# EAGLE design breakout_v3 (EAGLE 9.6.2)
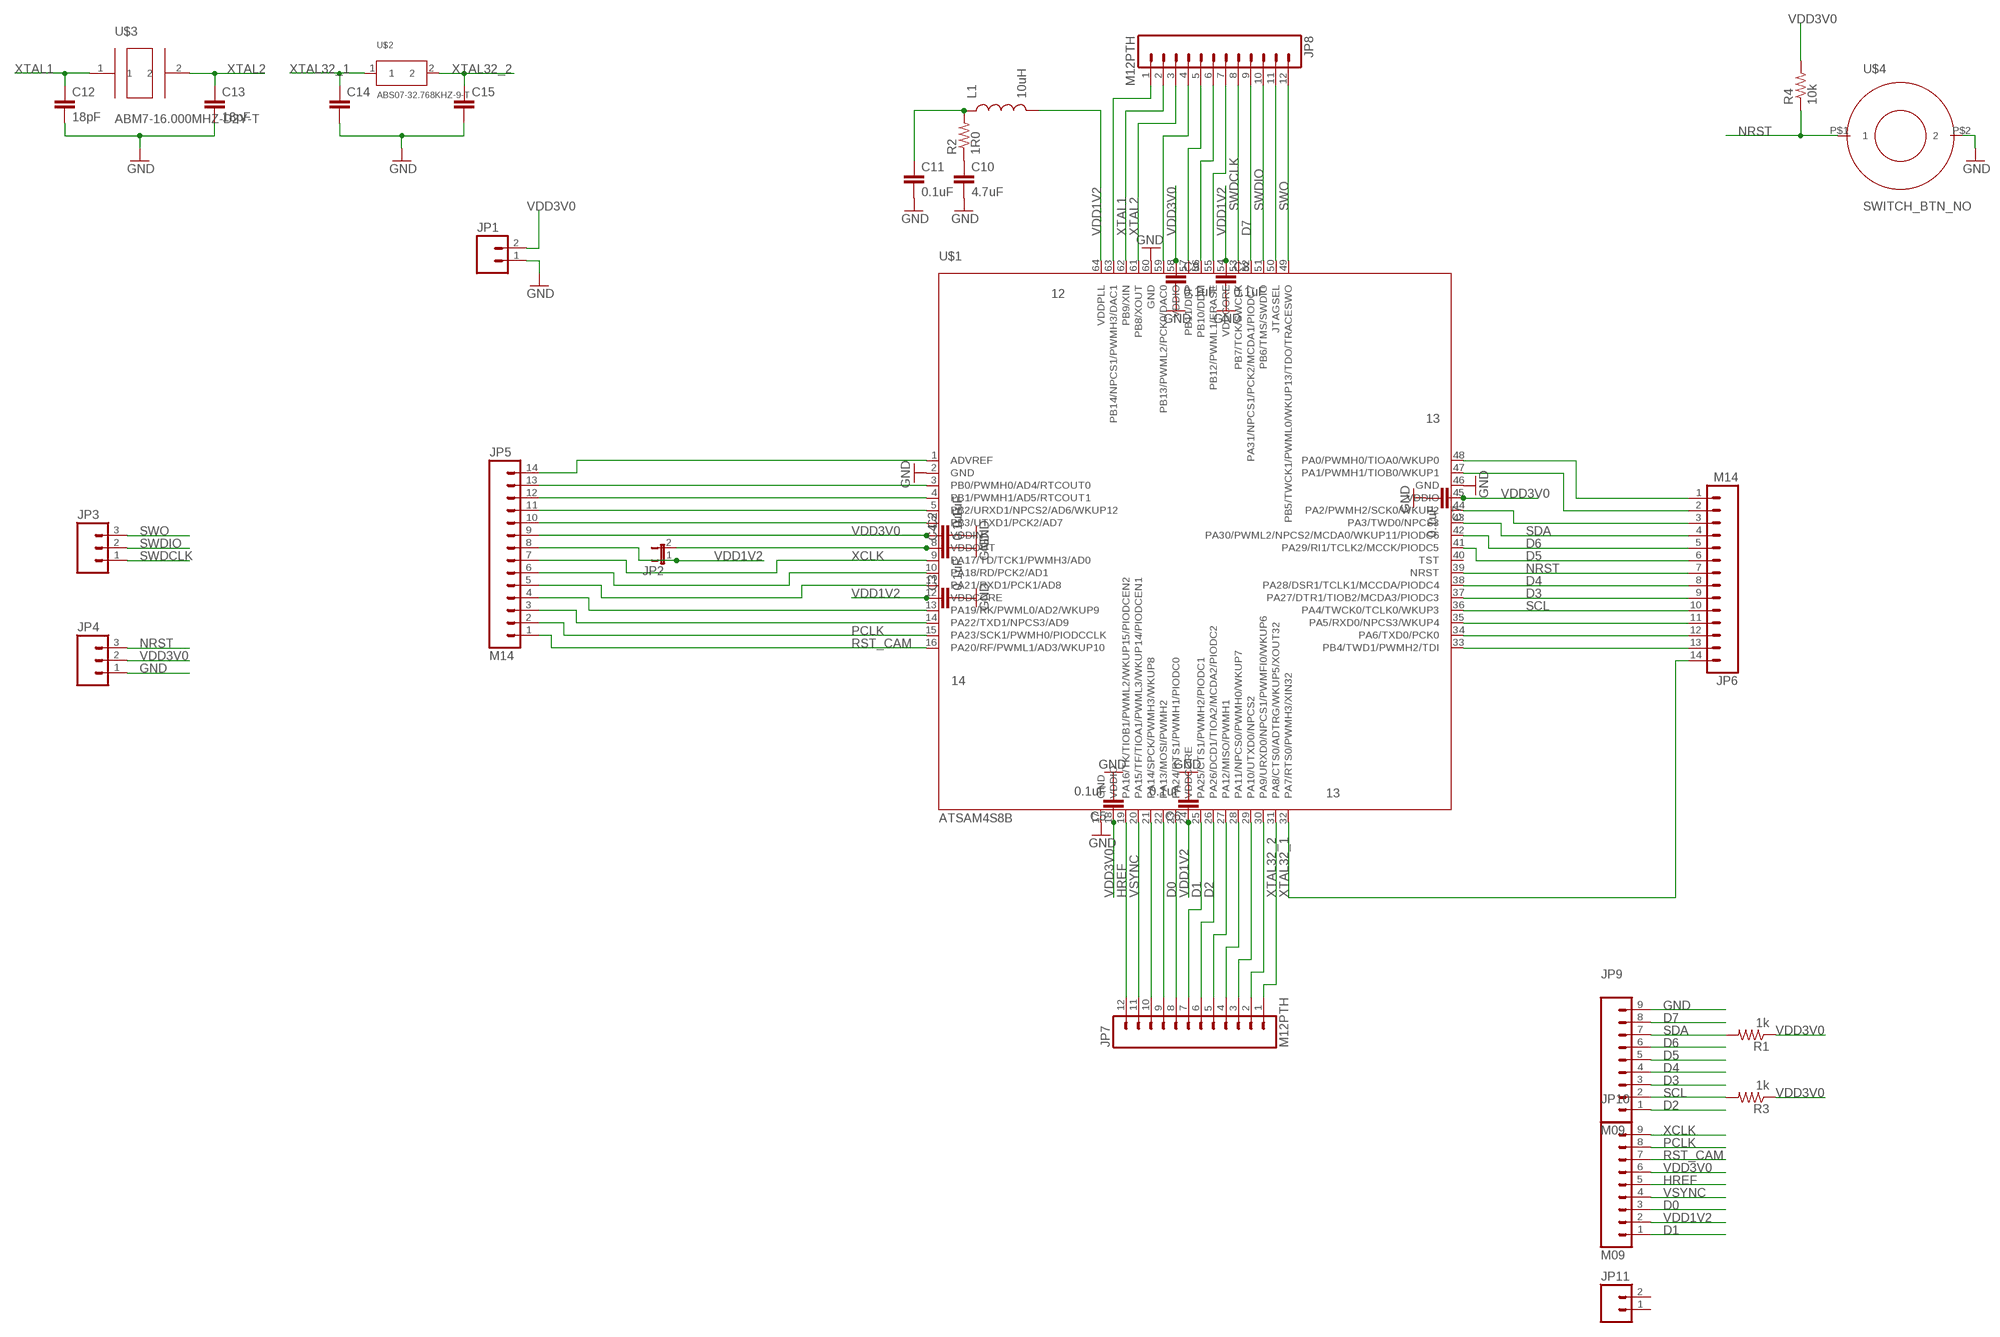
[diagram p0: schematic, sheet 1]

## Parts
C2  0.1uF  CAP0805  [0805]
C3  0.1uF  CAP0805  [0805]
C4  0.1uF  CAP0805  [0805]
C5  0.1uF  CAP0805  [0805]
C6  0.1uF  CAP0805  [0805]
C7  0.1uF  CAP0805  [0805]
C8  0.1uF  CAP0805  [0805]
C9  0.1uF  CAP0805  [0805]
C10  4.7uF  CAP0805  [0805]
C11  0.1uF  CAP0805  [0805]
C12  18pF  CAP0805  [0805]
C13  18pF  CAP0805  [0805]
C14  CAP0805  [0805]
C15  CAP0805  [0805]
JP1  M02PTH  [1X02]
JP2  JUMPER-2PTH  [1X02]
JP3  M03PTH  [1X03]
JP4  M03PTH  [1X03]
JP5  M14  [1X14]
JP6  M14  [1X14]
JP7  M12PTH  [1X12]
JP8  M12PTH  [1X12]
JP9  M09  [1X09]
JP10  M09  [1X09]
JP11  M02PTH  [1X02]
L1  10uH  INDUCTOR0805  [0805]
R1  1k  RESISTOR0805-RES  [0805]
R2  1R0  RESISTOR0805-RES  [0805]
R3  1k  RESISTOR0805-RES  [0805]
R4  10k  RES  [0805]
U$1  ATSAM4S8B  [QFP50P1200X1200X160-64N]
U$2  ABS07-32.768KHZ-9-T  [ABS07-32.768KHZ-9-T]
U$3  ABM7-16.000MHZ-D2Y-T  [ABM7-16.000MHZ-D2Y-T]
U$4  SWITCH_BTN_NO  [BTN_2]

## Nets
D0: JP7.8 JP10.3 U$1.23(PA24/RTS1/PWMH1/PIODC0)
D1: JP7.7 JP10.1 U$1.25(PA25/CTS1/PWMH2/PIODC1)
D2: JP7.6 JP9.1 U$1.26(PA26/DCD1/TIOA2/MCDA2/PIODC2)
D3: JP6.9 JP9.3 U$1.37(PA27/DTR1/TIOB2/MCDA3/PIODC3)
D4: JP6.8 JP9.4 U$1.38(PA28/DSR1/TCLK1/MCCDA/PIODC4)
D5: JP6.6 JP9.5 U$1.41(PA29/RI1/TCLK2/MCCK/PIODC5)
D6: JP6.5 JP9.6 U$1.42(PA30/PWML2/NPCS2/MCDA0/WKUP11/PIODC6)
D7: JP8.9 JP9.8 U$1.52(PA31/NPCS1/PCK2/MCDA1/PIODC7)
GND: C2.2 C3.2 C4.2 C5.2 C6.2 C7.2 C8.2 C9.2 C10.2 C11.2 C12.2 C13.2 C14.2 C15.2 JP1.1 JP4.1 JP9.9 U$1.2(GND) U$1.17(GND) U$1.46(GND) U$1.60(GND) U$4.P$2
HREF: JP7.12 JP10.5 U$1.19(PA16/TK/TIOB1/PWML2/WKUP15/PIODCEN2)
N$1: C4.1 JP2.2 U$1.8(VDDOUT)
N$2: C11.1 L1.1 R2.2
N$3: C10.1 R2.1
N$10: JP5.14 U$1.1(ADVREF)
N$11: JP5.13 U$1.3(PB0/PWMH0/AD4/RTCOUT0)
N$12: JP5.12 U$1.4(PB1/PWMH1/AD5/RTCOUT1)
N$13: JP5.11 U$1.5(PB2/URXD1/NPCS2/AD6/WKUP12)
N$14: JP5.10 U$1.6(PB3/UTXD1/PCK2/AD7)
N$16: JP5.6 U$1.10(PA18/RD/PCK2/AD1)
N$17: JP5.5 U$1.11(PA21/RXD1/PCK1/AD8)
N$18: JP5.4 U$1.13(PA19/RK/PWML0/AD2/WKUP9)
N$19: JP5.3 U$1.14(PA22/TXD1/NPCS3/AD9)
N$24: JP7.10 U$1.21(PA14/SPCK/PWMH3/WKUP8)
N$25: JP7.9 U$1.22(PA13/MOSI/PWMH2)
N$29: JP7.5 U$1.27(PA12/MISO/PWMH1)
N$30: JP7.4 U$1.28(PA11/NPCS0/PWMH0/WKUP7)
N$31: JP7.3 U$1.29(PA10/UTXD0/NPCS2)
N$32: JP7.2 U$1.30(PA9/URXD0/NPCS1/PWMFI0/WKUP6)
N$33: JP6.13 U$1.33(PB4/TWD1/PWMH2/TDI)
N$34: JP6.12 U$1.34(PA6/TXD0/PCK0)
N$35: JP6.11 U$1.35(PA5/RXD0/NPCS3/WKUP4)
N$42: JP6.3 U$1.44(PA2/PWMH2/SCK0/WKUP2)
N$43: JP6.2 U$1.47(PA1/PWMH1/TIOB0/WKUP1)
N$44: JP6.1 U$1.48(PA0/PWMH0/TIOA0/WKUP0)
N$45: JP8.11 U$1.50(JTAGSEL)
N$47: JP8.7 U$1.55(PB12/PWML1/ERASE)
N$48: JP8.6 U$1.56(PB10/DDM)
N$49: JP8.5 U$1.57(PB11/DDP)
N$50: JP8.4 U$1.59(PB13/PWML2/PCK0/DAC0)
N$51: JP8.1 U$1.63(PB14/NPCS1/PWMH3/DAC1)
NRST: JP4.3 JP6.7 R4.1 U$1.39(NRST) U$4.P$1
PCLK: JP5.2 JP10.8 U$1.15(PA23/SCK1/PWMH0/PIODCCLK)
RST_CAM: JP5.1 JP10.7 U$1.16(PA20/RF/PWML1/AD3/WKUP10)
SCL: JP6.10 JP9.2 R3.2 U$1.36(PA4/TWCK0/TCLK0/WKUP3)
SDA: JP6.4 JP9.7 R1.2 U$1.43(PA3/TWD0/NPCS3)
SWDCLK: JP3.1 JP8.8 U$1.53(PB7/TCK/SWCLK)
SWDIO: JP3.2 JP8.10 U$1.51(PB6/TMS/SWDIO)
SWO: JP3.3 JP8.12 U$1.49(PB5/TWCK1/PWML0/WKUP13/TDO/TRACESWO)
VDD1V2: C3.1 C6.1 C8.1 JP2.1 JP5.8 JP10.2 L1.2 U$1.12(VDDCORE) U$1.24(VDDCORE) U$1.54(VDDCORE) U$1.64(VDDPLL)
VDD3V0: C2.1 C5.1 C7.1 C9.1 JP1.2 JP4.2 JP5.9 JP10.6 R1.1 R3.1 R4.2 U$1.7(VDDIN) U$1.18(VDDIO) U$1.45(VDDIO) U$1.58(VDDIO)
VSYNC: JP7.11 JP10.4 U$1.20(PA15/TF/TIOA1/PWML3/WKUP14/PIODCEN1)
XCLK: JP5.7 JP10.9 U$1.9(PA17/TD/TCK1/PWMH3/AD0)
XTAL1: C12.1 JP8.2 U$1.62(PB9/XIN) U$3.1
XTAL2: C13.1 JP8.3 U$1.61(PB8/XOUT) U$3.2
XTAL32_1: C14.1 JP6.14 U$1.32(PA7/RTS0/PWMH3/XIN32) U$2.1
XTAL32_2: C15.1 JP7.1 U$1.31(PA8/CTS0/ADTRG/WKUP5/XOUT32) U$2.2
Unconnected: JP11.1 JP11.2 U$1.40(TST)

## Notes on the sheet
- 12
- 13
- 14
- 13

## Library data of the parts
C2-C15 = SparkFun:CAP: Capacitor Standard 0603 ceramic capacitor, and 0.1" leaded capacitor.
JP1 JP11 = SparkFun:M02: Header 2 Standard 2-pin 0.1" header. Use with straight break away headers (SKU : PRT-00116), right angle break away headers (PRT-00553), swiss pins (PRT-00743), machine pins (PRT-00117), and female headers (PRT-00115). Molex polarized connector foot print use with SKU : PRT-08233 with associated crimp pins and housings.
JP2 = SparkFun:JUMPER-2: Jumper Basic 0.1" spaced jumper. Use with breakaway headers.
JP3 JP4 = SparkFun:M03: Header 3 Standard 3-pin 0.1" header. Use with straight break away headers (SKU : PRT-00116), right angle break away headers (PRT-00553), swiss pins (PRT-00743), machine pins (PRT-00117), and female headers (PRT-00115). Molex polarized connector foot print use with SKU : PRT-08232 with associated crimp pins and housings.
JP5 JP6 = SparkFun:M14: Header 14 Standard 14-pin 0.1" header. Use with straight break away headers (SKU : PRT-00116), right angle break away headers (PRT-00553), swiss pins (PRT-00743), machine pins (PRT-00117), and female headers (PRT-00115).
JP7 JP8 = SparkFun:M12: Header 12 Standard 12-pin 0.1" header. Use with straight break away headers (SKU : PRT-00116), right angle break away headers (PRT-00553), swiss pins (PRT-00743), machine pins (PRT-00117), and female headers (PRT-00115).
JP9 JP10 = SparkFun:M09: Header 9 Standard 9-pin 0.1" header. Use with straight break away headers (SKU : PRT-00116), right angle break away headers (PRT-00553), swiss pins (PRT-00743), machine pins (PRT-00117), and female headers (PRT-00115).
L1 = SparkFun:INDUCTOR: Inductors Basic Inductor/Choke - 0603 and 1206. Footprints are not proven and vary greatly between part numbers.
R1-R3 = SparkFun:RESISTOR: Resistor Basic schematic elements and footprints for 0603, 1206, and PTH resistors.
R4 = Ilya_Teach:RES
U$1 = Ilya:ATSAM4S8B
U$2 = Ilya:ABS07-32.768KHZ-9-T
U$3 = Ilya:ABM7-16.000MHZ-D2Y-T
U$4 = Ilya_Teach:SWITCH_BTN_NO

## Board
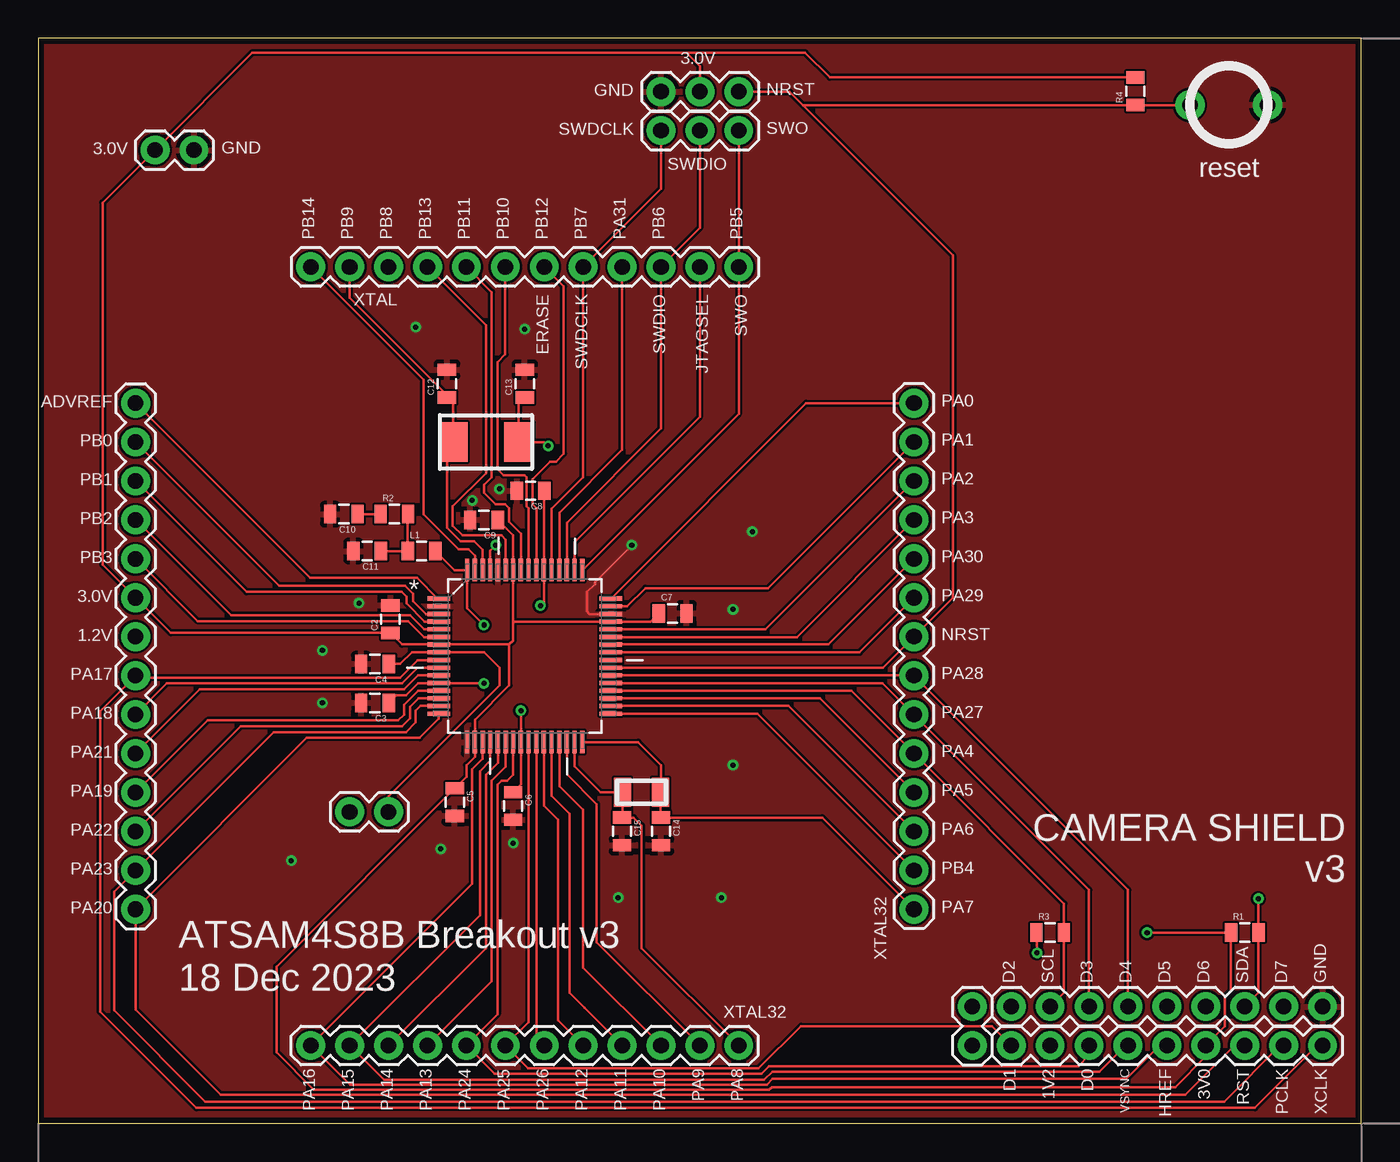
[diagram p1: board, top side]
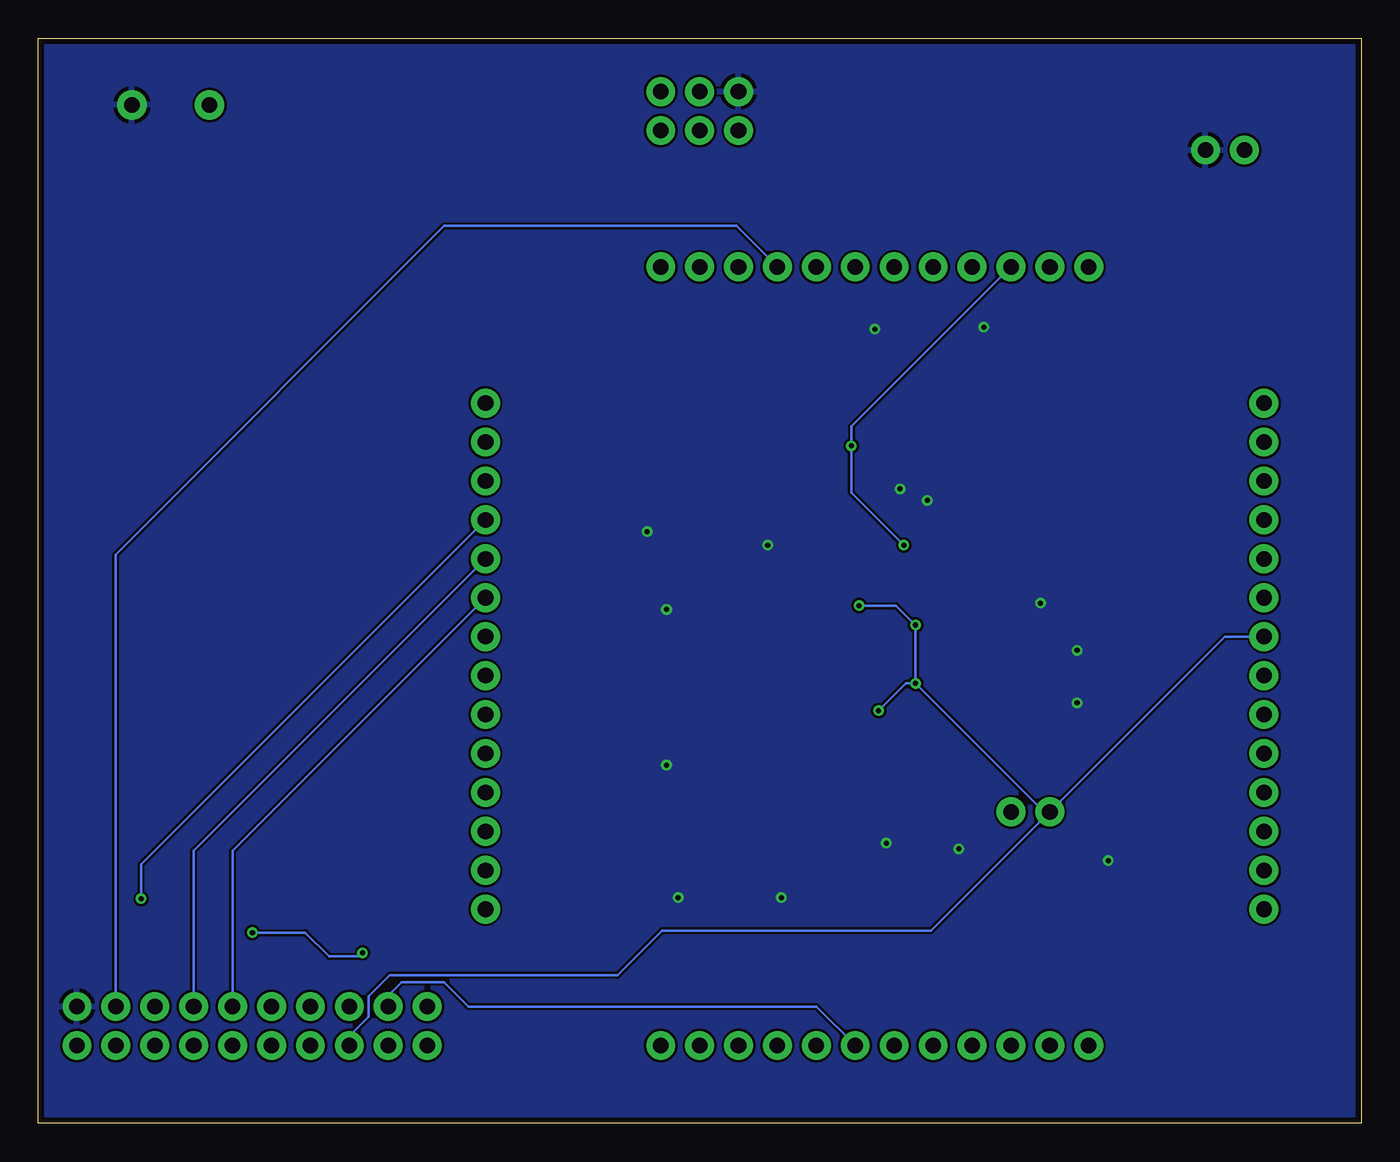
[diagram p2: board, bottom side, seen from below]

Size 86.34 x 70.79 mm. Coordinates in mm from the lower left corner, seen from the top.
Outline: 0,0 86.34,0 86.34,70.79 0,70.79 0,0
Copper layers (1*16): Top 0.0356mm / dielectric 1.5011mm / Bottom 0.0356mm
Design rules "LaenPCBOrder": minimum track width 6mil, minimum drill 13mil, track to track 6mil, track to pad 6mil, pad to pad 6mil, via to via 6mil, smd to smd 6mil, copper to edge 15mil, drill to drill 6mil, minimum pad ring 7mil, minimum via ring 7mil, stop-mask expansion 4mil, vias tented up to drill 0mil, thermal gap 10mil

### Footprints (pad centres in the part's own frame; a part is rotated, then mirrored left to right if it is on the bottom)
0805 = smd 0.8 x 1.2: 1 -0.9,0; 2 0.9,0
1X02 = drill 1.016 pad 1.88: 1 0,0; 2 2.54,0
1X03 = drill 1.016 pad 1.88: 1 0,0; 2 2.54,0; 3 5.08,0
1X14 = drill 1.016 pad 1.88: 1 0,0; 2 2.54,0; 3 5.08,0; 4 7.62,0; 5 10.16,0; 6 12.7,0; 7 15.24,0; 8 17.78,0; 9 20.32,0; 10 22.86,0; 11 25.4,0; 12 27.94,0; 13 30.48,0; 14 33.02,0
1X12 = drill 1.016 pad 1.88: 1 0,0; 2 2.54,0; 3 5.08,0; 4 7.62,0; 5 10.16,0; 6 12.7,0; 7 15.24,0; 8 17.78,0; 9 20.32,0; 10 22.86,0; 11 25.4,0; 12 27.94,0
1X09 = drill 1.016 pad 1.88: 1 0,0; 2 2.54,0; 3 5.08,0; 4 7.62,0; 5 10.16,0; 6 12.7,0; 7 15.24,0; 8 17.78,0; 9 20.32,0
QFP50P1200X1200X160-64N = smd 1.473 x 0.279: 1 -5.613,3.759; 2 -5.613,3.251; 3 -5.613,2.743; 4 -5.613,2.261; 5 -5.613,1.753; 6 -5.613,1.245; 7 -5.613,0.762; 8 -5.613,0.254; 9 -5.613,-0.254; 10 -5.613,-0.762; 11 -5.613,-1.245; 12 -5.613,-1.753; 13 -5.613,-2.261; 14 -5.613,-2.743; 15 -5.613,-3.251; 16 -5.613,-3.759; 33 5.613,-3.759; 34 5.613,-3.251; 35 5.613,-2.743; 36 5.613,-2.261; 37 5.613,-1.753; 38 5.613,-1.245; 39 5.613,-0.762; 40 5.613,-0.254; 41 5.613,0.254; 42 5.613,0.762; 43 5.613,1.245; 44 5.613,1.753; 45 5.613,2.261; 46 5.613,2.743; 47 5.613,3.251; 48 5.613,3.759 | smd 0.279 x 1.473: 17 -3.759,-5.613; 18 -3.251,-5.613; 19 -2.743,-5.613; 20 -2.261,-5.613; 21 -1.753,-5.613; 22 -1.245,-5.613; 23 -0.762,-5.613; 24 -0.254,-5.613; 25 0.254,-5.613; 26 0.762,-5.613; 27 1.245,-5.613; 28 1.753,-5.613; 29 2.261,-5.613; 30 2.743,-5.613; 31 3.251,-5.613; 32 3.759,-5.613; 49 3.759,5.613; 50 3.251,5.613; 51 2.743,5.613; 52 2.261,5.613; 53 1.753,5.613; 54 1.245,5.613; 55 0.762,5.613; 56 0.254,5.613; 57 -0.254,5.613; 58 -0.762,5.613; 59 -1.245,5.613; 60 -1.753,5.613; 61 -2.261,5.613; 62 -2.743,5.613; 63 -3.251,5.613; 64 -3.759,5.613
ABS07-32.768KHZ-9-T = smd 1.1 x 1.9: 1 -1.25,0; 2 1.25,0
ABM7-16.000MHZ-D2Y-T = smd 1.9 x 2.6: 1 -2.15,0; 2 2.15,0
BTN_2 = drill 1.016 pad 1.93: P$1 -2.54,0; P$2 2.54,0

### Placement (x,y rotation side)
C2  22.99,32.89 90 top
C3  21.97,27.43 180 top
C4  21.97,29.97 180 top
C5  27.18,20.95 270 top
C6  30.99,20.7 270 top
C7  41.4,33.27 0 top
C8  32.13,41.27 180 top
C9  29.08,39.37 180 top
C10  19.94,39.75 180 top
C11  21.46,37.34 180 top
C12  26.67,48.26 90 top
C13  31.75,48.26 90 top
C14  40.64,19.05 270 top
C15  38.1,19.05 270 top
JP1  10.16,63.5 180 top
JP2  20.32,20.32 0 top
JP3  40.64,64.77 0 top
JP4  40.64,67.31 0 top
JP5  6.35,13.97 90 top
JP6  57.15,46.99 270 top
JP7  45.72,5.08 180 top
JP8  17.78,55.88 0 top
JP9  63.5,7.62 0 top
JP10  63.5,5.08 0 top
JP11  60.96,5.08 90 top
L1  25.02,37.34 0 top
R1  78.74,12.45 0 top
R2  23.24,39.75 0 top
R3  66.04,12.45 0 top
R4  71.6,67.34 90 top
U$1  31.75,30.48 0 top
U$2  39.37,21.59 180 top
U$3  29.21,44.45 0 top
U$4  77.7,66.45 0 top

### Tracks (layer width: path | path; a pad name or v marks a point on that pad's centre or on a via)
D0
  Top 0.152: U$1.23 30.99,22.73 30.61,22.35 30.23,22.35 29.97,22.1 29.97,7.11 JP7.8 29.79,3.23 47.19,3.23 47.7,3.73 67.87,3.73 68.58,4.45 JP10.3
D1
  Top 0.152: U$1.25 32,6.6 JP7.7 31.98,3.58 47.02,3.58 49.78,6.35 62.23,6.35 JP10.1
D2
  Top 0.152: U$1.26 32.51,5.59 JP7.6
  Bottom 0.152: JP7.6 35.56,7.62 58.27,7.62 59.84,9.2 62.64,9.2 63.5,8.33 JP9.1
D3
  Top 0.152: U$1.37 55.09,28.73 JP6.9 68.58,15.24 JP9.3
D4
  Top 0.152: U$1.38 57.12,29.23 JP6.8 71.12,15.24 JP9.4
D5
  Top 0.152: U$1.41 53.59,30.73 JP6.6
  Bottom 0.152: JP9.5 73.66,17.78 JP6.6
D6
  Top 0.152: U$1.42 51.56,31.24 JP6.5
  Bottom 0.152: JP9.6 76.2,17.78 JP6.5
D7
  Top 0.152: U$1.52 34.01,39.85 38.1,43.94 JP8.9
  Bottom 0.152: JP9.8 81.28,37.11 59.84,58.55 40.77,58.55 JP8.9
GND  (via drill 0.33)
  Top 0.152: U$1.46 35.99,33.22 35.81,33.4 35.81,34.67 36.32,35.18 36.32,35.31 v38.73,37.72
  other vias: 45.34,33.53 28.32,40.64 31.75,51.82 24.64,51.94 37.85,14.73 30.99,18.29 18.54,30.86 18.54,27.43 30.1,41.4 44.58,14.73 46.61,38.61 45.34,23.37 26.26,17.91 16.51,17.14 20.93,33.93
  pour Top: 0,0 86.36,0 86.36,71.12 0,71.12
  pour Bottom: 0,0 86.36,0 86.36,71.12 0,71.12
HREF
  Top 0.152: U$1.19 29.01,23.8 28.32,23.11 28.32,15.62 JP7.12 20.34,2.52 47.55,2.52 47.93,2.9 71.02,2.9 73.2,5.08 JP10.5
N$1
  Top 0.152: C4.1 23.62,29.97 24.38,30.73 U$1.8 29.08,30.73 30.1,29.72 30.1,28.57 22.86,21.34 JP2.2
N$2
  Top 0.152: R2.2 24.12,39.73 L1.1 C11.1
N$3
  Top 0.152: R2.1 C10.1
N$10
  Top 0.152: U$1.1 26.06,34.24 24.71,35.59 17.76,35.59 JP5.14
N$11
  Top 0.152: U$1.3 25.3,33.22 24.46,34.06 24.46,34.54 23.93,35.08 15.72,35.08 JP5.13
N$12
  Top 0.152: U$1.4 25.22,32.74 24.03,33.93 24.03,34.34 23.7,34.67 13.59,34.67 JP5.12
N$13
  Top 0.152: U$1.5 25.17,32.23 24.26,33.15 12.57,33.15 JP5.11
N$14
  Top 0.152: U$1.6 25.17,31.73 24.13,32.77 10.41,32.77 JP5.10
N$16
  Top 0.152: U$1.10 24.77,29.72 23.75,28.7 8.38,28.7 JP5.6
N$17
  Top 0.152: U$1.11 24.79,29.23 23.88,28.32 10.54,28.32 JP5.5
N$18
  Top 0.152: U$1.13 24.79,28.22 23.88,27.3 23.88,26.67 23.49,26.29 11.05,26.29 JP5.4
N$19
  Top 0.152: U$1.14 24.82,27.74 24.26,27.18 24.26,26.42 23.75,25.91 13.21,25.91 JP5.3
N$24
  Top 0.152: U$1.21 30,23.52 29.21,22.73 29.21,11.43 JP7.10
N$25
  Top 0.152: U$1.22 30.51,23.27 29.59,22.35 29.59,9.27 JP7.9
N$29
  Top 0.152: U$1.27 33,20.73 33.91,19.81 33.91,6.73 JP7.5
N$30
  Top 0.152: U$1.28 33.5,21.36 34.67,20.19 34.67,8.51 35.65,7.53 JP7.4
N$31
  Top 0.152: U$1.29 34.01,22 35.56,20.45 35.56,10.16 JP7.3
N$32
  Top 0.152: U$1.30 34.49,22.78 36.45,20.83 36.45,11.81 JP7.2
N$33
  Top 0.152: U$1.33 46.94,26.72 JP6.13
N$34
  Top 0.152: U$1.34 48.97,27.23 JP6.12
N$35
  Top 0.152: U$1.35 51,27.74 JP6.11
N$42
  Top 0.152: U$1.44 47.47,32.23 JP6.3
N$43
  Top 0.152: U$1.47 38.43,33.73 39.62,34.92 47.62,34.92 JP6.2
N$44
  Top 0.152: U$1.48 50.11,46.99 JP6.1
N$45
  Top 0.152: U$1.50 35,37.92 43.18,46.1 JP8.11
N$47
  Top 0.152: U$1.55 32.51,40.13 32.26,40.39 32.26,42.04 33.4,43.18 33.78,43.18 34.29,43.69 34.29,54.61 JP8.7
N$48
  Top 0.152: U$1.56 32,40.13 31.88,40.26 31.88,42.16 31.75,42.29 30.35,42.29 29.97,42.67 29.97,49.66 30.48,50.16 JP8.6
N$49
  Top 0.152: JP8.5 29.59,54.23 29.59,42.16 29.08,41.66 29.08,41.15 29.84,40.39 30.48,40.39 30.73,40.13 30.73,39.24 31.5,38.48 U$1.57
N$50
  Top 0.152: JP8.4 29.21,52.07 29.21,42.42 27.05,40.26 27.05,38.99 27.69,38.35 30.23,38.35 30.51,38.08 U$1.59
N$51
  Top 0.152: JP8.1 25.15,48.51 25.15,39.75 27.43,37.47 28.07,37.47 28.5,37.03 U$1.63
NRST
  Top 0.152: U$1.39 55.12,29.72 JP6.7 59.69,34.29 59.69,56.64 49.91,66.42 | JP4.3 49.02,67.31 49.91,66.42 | U$4.P$1 75.15,66.44 R4.1 49.93,66.44 49.91,66.42
PCLK
  Top 0.152: U$1.15 24.94,27.23 24.64,26.92 24.64,26.16 24,25.53 15.37,25.53 JP5.2 4.95,15.11 4.95,7.37 10.9,1.42 77.39,1.42 81.05,5.08 JP10.8
RST_CAM
  Top 0.152: U$1.16 26.14,26.39 24.89,25.15 17.53,25.15 JP5.1 6.35,7.42 11.91,1.85 74.85,1.85 78.08,5.08 JP10.7
SCL
  Top 0.152: U$1.36 53.06,28.22 JP6.10 66.94,14.34 R3.2 66.94,8.52 JP9.2
SDA  (via drill 0.33)
  Top 0.152: U$1.43 49.51,31.73 JP6.4 | JP9.7 79.64,8.52 R1.2 79.64,14.64 v79.63,14.66
  Bottom 0.152: JP6.4 79.63,16.89 v79.63,14.66
SWDCLK
  Top 0.152: U$1.53 33.5,40.11 35.56,42.16 JP8.8 40.64,60.96 JP3.1
SWDIO
  Top 0.152: U$1.51 34.49,39.19 40.64,45.34 JP8.10 43.18,58.42 JP3.2
SWO
  Top 0.152: U$1.49 45.72,46.3 JP8.12 JP3.3
VDD1V2  (via drill 0.33)
  Top 0.152: C8.1 33,41.24 U$1.54 33,34.01 v32.77,33.78 | L1.2 27.16,36.09 U$1.64 27.99,33.6 v29.08,32.51 | v29.08,28.7 29.06,28.73 U$1.12 24.79,28.73 24,27.94 23.38,27.94 C3.1 | v31.5,26.92 U$1.24 31.5,22.11 C6.1
  Bottom 0.152: v29.08,28.7 29.72,28.7 v31.5,26.92 | v29.08,28.7 v29.08,32.51 30.35,33.78 v32.77,33.78 | JP2.1 20.7,20.32 v29.08,28.7 | JP5.8 8.89,31.75 JP2.1 | JP2.1 28.07,12.57 45.62,12.57 48.54,9.65 63.42,9.65 64.77,8.31 64.77,6.96 66.04,5.69 JP10.2
VDD3V0  (via drill 0.33)
  Top 0.152: C9.1 30.99,38.37 U$1.58 30.99,32.77 | 30.99,32.77 30.99,31.5 30.73,31.24 | 30.73,31.24 U$1.7 23.74,31.24 C2.1 8.65,31.99 JP5.9 4.19,36.45 4.19,60.07 JP1.2 13.97,69.85 42.29,69.85 | 30.99,32.77 31.01,32.74 U$1.45 39.97,32.74 C7.1 | 30.73,31.24 30.73,28.57 28.5,26.34 U$1.18 28.5,23.93 27.94,23.37 27.94,22.62 C5.1 15.54,10.22 15.54,4.62 17.98,2.18 47.7,2.18 47.88,2.36 74.19,2.36 76.2,4.37 JP10.6 77.45,6.33 77.45,8.26 77.84,8.65 R1.1 v72.36,12.45 | JP4.2 43.18,68.96 42.29,69.85 | v65.18,11.12 65.18,12.41 R3.1 | R4.2 51.65,68.23 50.04,69.85 42.29,69.85
  Bottom 0.152: v72.36,12.45 68.91,12.45 67.36,10.9 65.41,10.9 v65.18,11.12
VSYNC
  Top 0.152: U$1.20 29.49,23.65 28.83,22.99 28.83,13.59 JP7.11 22.55,2.85 47.37,2.85 47.9,3.38 69.27,3.38 70.97,5.08 JP10.4
XCLK
  Top 0.152: U$1.9 24.77,30.23 23.62,29.08 6.48,29.08 JP5.7 4.04,26.9 4.04,7.29 10.31,1.02 79.4,1.02 83.46,5.08 JP10.9
XTAL1
  Top 0.152: U$1.62 29.01,37.41 28.45,37.97 27.56,37.97 26.67,38.86 26.67,44.06 U$3.1 27.06,46.97 C12.1 26.67,47.5 20.32,53.85 JP8.2
XTAL2  (via drill 0.33)
  Top 0.152: C13.1 31.36,46.97 U$3.2 33.02,44.45 v33.27,44.2 | U$1.61 29.49,37.36 v29.84,37.72
  Bottom 0.152: v29.84,37.72 33.27,41.15 v33.27,44.2 33.27,45.47 JP8.3
XTAL32_1
  Top 0.152: U$1.32 39.14,24.87 40.64,23.37 40.64,21.61 U$2.1 40.62,19.97 C14.1 51.17,19.95 JP6.14
XTAL32_2
  Top 0.152: U$1.31 35,23.29 36.7,21.59 U$2.2 38.12,19.97 C15.1 38.85,19.95 39.37,19.43 39.37,11.43 JP7.1

### Text on the board
tPlace: 3.0V | GND | NRST | SWDCLK | SWO | 3.0V | GND | SWDIO | reset | PB14 | PB9 | PB8 | PB13 | PB11 | PB10 | PB12 | PB7 | PA31 | PB6 | PB5 | ERASE | SWDCLK | SWDIO | JTAGSEL | SWO | XTAL | ADVREF | PA0 | PB0 | PA1 | PB1 | PA2 | PB2 | PA3 | PB3 | PA30 | 3.0V | PA29 | 1.2V | NRST | PA17 | PA28 | PA18 | PA27 | PA21 | PA4 | PA19 | PA5 | PA22 | PA6 | PA23 | PB4 | CAMERA SHIELD / v3 | PA20 | PA7 | ATSAM4S8B Breakout v3 | XTAL32 | 18 Dec 2023 | D2 | SCL | D3 | D4 | D5 | D6 | SDA | D7 | GND | XTAL32 | PA16 | PA15 | PA14 | PA13 | PA24 | PA25 | PA26 | PA12 | PA11 | PA10 | PA9 | PA8 | D1 | 1V2 | D0 | VSYNC | HREF | 3V0 | RST | PCLK | XCLK